# EAGLE schematic main (EAGLE 9.3.0)
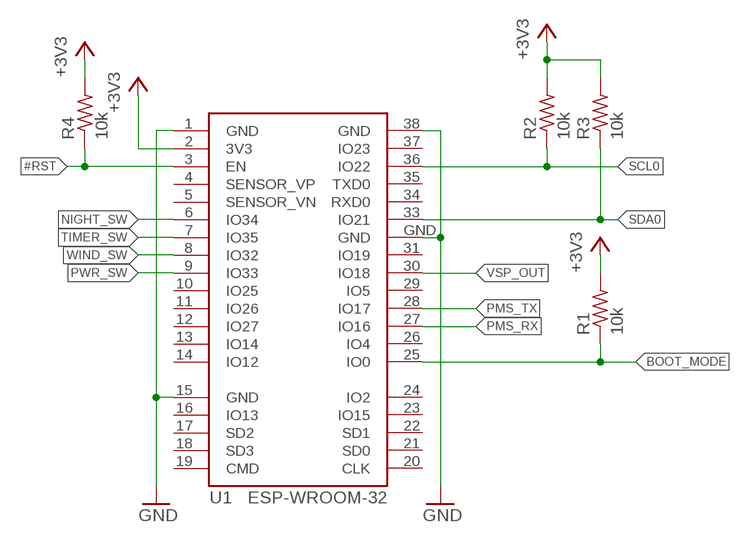
[diagram p0: schematic, sheet 1]

## Parts
R1  10k  R-US_R0603  [R0603]
R2  10k  R-US_R0603  [R0603]
R3  10k  R-US_R0603  [R0603]
R4  10k  R-US_R0603  [R0603]
U1  ESP-WROOM-32  [ESP-WROOM-32]

## Nets
#RST: R4.1 U1.3(EN)
+3V3: R1.2 R2.2 R3.2 R4.2 U1.2(3V3)
BOOT_MODE: R1.1 U1.25(IO0)
GND: U1.1(GND) U1.15(GND) U1.38(GND) U1.GND
NIGHT_SW: U1.6(IO34)
PMS_RX: U1.27(IO16)
PMS_TX: U1.28(IO17)
PWR_SW: U1.9(IO33)
SCL0: R2.1 U1.36(IO22)
SDA0: R3.1 U1.33(IO21)
TIMER_SW: U1.7(IO35)
VSP_OUT: U1.30(IO18)
WIND_SW: U1.8(IO32)
Unconnected: U1.4(SENSOR_VP) U1.5(SENSOR_VN) U1.10(IO25) U1.11(IO26) U1.12(IO27) U1.13(IO14) U1.14(IO12) U1.16(IO13) U1.17(SD2) U1.18(SD3) U1.19(CMD) U1.20(CLK) U1.21(SD0) U1.22(SD1) U1.23(IO15) U1.24(IO2) U1.26(IO4) U1.29(IO5) U1.31(IO19) U1.34(RXD0) U1.35(TXD0) U1.37(IO23)

## Library data of the parts
R1-R4 = rcl:R-US_: RESISTOR, American symbol; SPICEPREFIX: R
U1 = esp32:ESP-WROOM-32: Espressif Systems ESP-WROOM-32